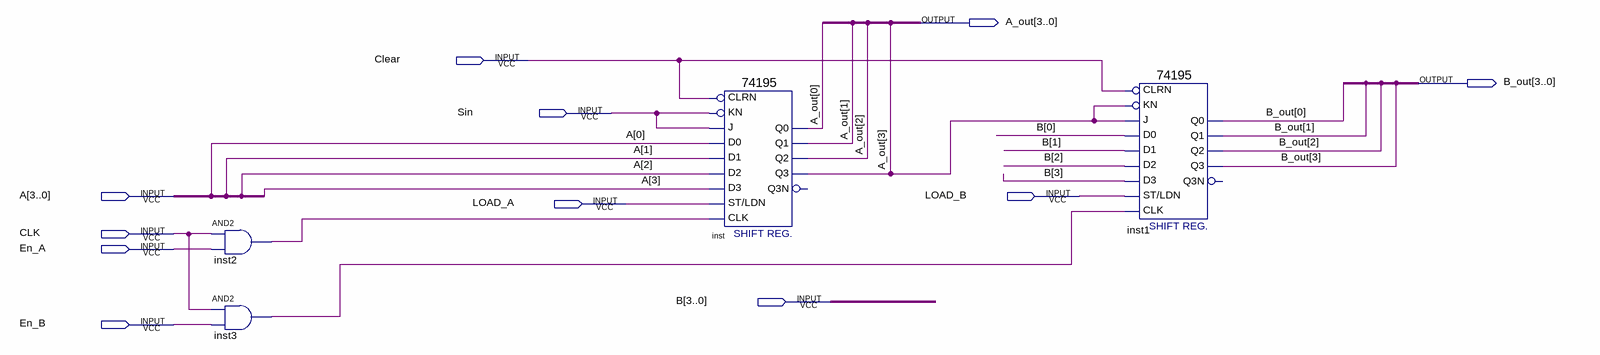
[diagram p0: schematic sheet]
// Quartus schematic register.bdf as structural Verilog: 4 symbols, 11 pins
module register (
  input  Clear,
  input  Sin,
  input  [3:0] A,
  input  LOAD_B,
  input  LOAD_A,
  input  CLK,
  input  En_A,
  input  [3:0] B,
  input  En_B,
  output [3:0] A_out,
  output [3:0] B_out
);

  wire inst2_out, inst3_out;

  and inst2 (inst2_out, CLK, En_A);
  and inst3 (inst3_out, CLK, En_B);
  \74195  inst (
    .\ST/LDN (LOAD_A), .KN(Sin), .CLRN(Clear), .D2(A[2]), .D1(A[1]), .D0(A[0]), .J(Sin), .CLK(inst2_out),
    .D3(A[3]), .Q3(A_out[3]), .Q0(A_out[0]), .Q1(A_out[1]), .Q2(A_out[2]));  // open: Q3N
  \74195  inst1 (
    .\ST/LDN (LOAD_B), .KN(A_out[3]), .CLRN(Clear), .D2(B[2]), .D1(B[1]), .D0(B[0]), .J(A_out[3]),
    .CLK(inst3_out), .D3(B[3]), .Q3(B_out[3]), .Q0(B_out[0]), .Q1(B_out[1]), .Q2(B_out[2]));  // open: Q3N
endmodule
